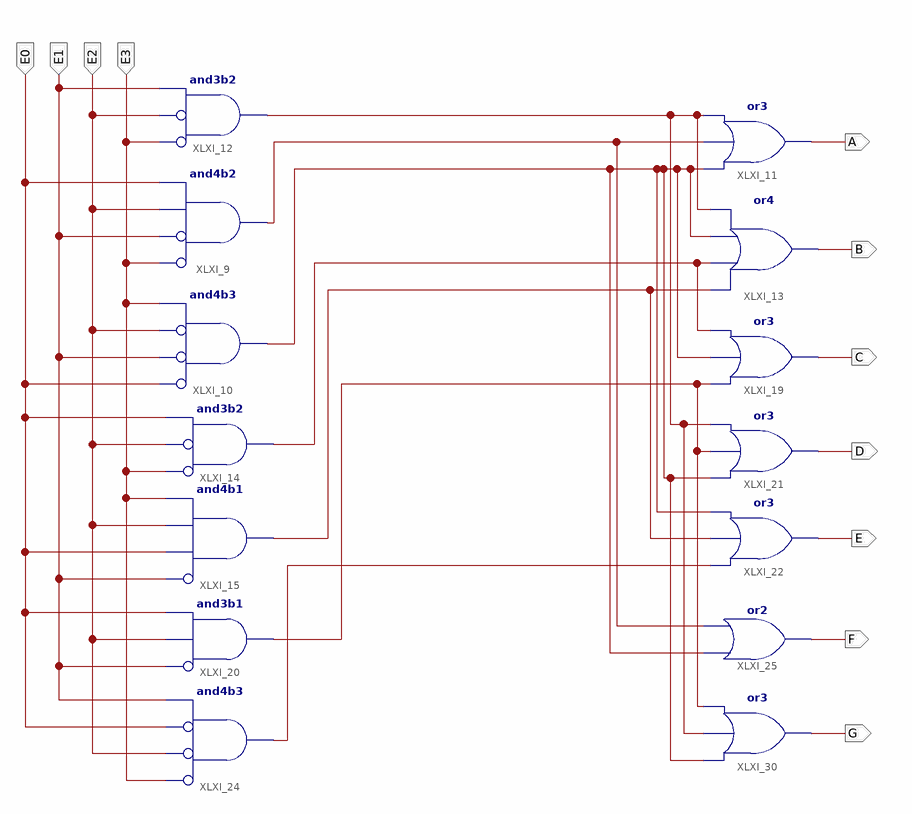
[diagram p0: schematic sheet 1]
// Xilinx ISE schematic SevenSchematic.sch (spartan3) as structural Verilog: 14 symbols, 11 ports
module SevenSchematic (
  input  E0,
  input  E1,
  input  E2,
  input  E3,
  output A,
  output B,
  output C,
  output D,
  output E,
  output F,
  output G
);

  wire XLXN_23, XLXN_34, XLXN_39, XLXN_43, XLXN_45, XLXN_47, XLXN_58;

  and XLXI_9 (XLXN_23, ~E3, ~E1, E2, E0);  // and4b2
  and XLXI_10 (XLXN_47, ~E0, ~E1, ~E2, E3);  // and4b3
  or XLXI_11 (A, XLXN_47, XLXN_23, XLXN_58);
  and XLXI_12 (XLXN_58, ~E3, ~E2, E1);  // and3b2
  and XLXI_14 (XLXN_39, ~E3, ~E2, E0);  // and3b2
  and XLXI_15 (XLXN_34, ~E1, E0, E2, E3);  // and4b1
  or XLXI_13 (B, XLXN_34, XLXN_39, XLXN_47, XLXN_58);
  or XLXI_19 (C, XLXN_43, XLXN_47, XLXN_39);
  and XLXI_20 (XLXN_43, ~E1, E2, E0);  // and3b1
  or XLXI_21 (D, XLXN_47, XLXN_43, XLXN_58);
  or XLXI_22 (E, XLXN_45, XLXN_34, XLXN_47);
  and XLXI_24 (XLXN_45, ~E3, ~E2, ~E0, E1);  // and4b3
  or XLXI_25 (F, XLXN_47, XLXN_23);
  or XLXI_30 (G, XLXN_47, XLXN_58, XLXN_43);
endmodule
